# EAGLE schematic Teensy_v1 (EAGLE 9.2.1)
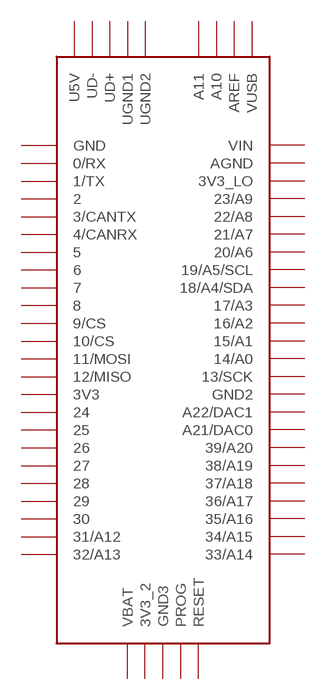
[diagram p0: schematic, sheet 1]

## Parts
U$1  TEENSY_3.5/3.6  [TEENSY_3.5/3.6]
Unconnected: U$1.0/RX U$1.1/TX U$1.2 U$1.3/CANTX U$1.3V3 U$1.3V3_2 U$1.3V3_LO U$1.4/CANRX U$1.5 U$1.6 U$1.7 U$1.8 U$1.9/CS U$1.10/CS U$1.11/MOSI U$1.12/MISO U$1.13/SCK U$1.14/A0 U$1.15/A1 U$1.16/A2 U$1.17/A3 U$1.18/A4/SDA U$1.19/A5/SCL U$1.20/A6 U$1.21/A7 U$1.21/DAC0(A21/DAC0) U$1.22/A8 U$1.23/A9 U$1.24 U$1.25 U$1.26 U$1.27 U$1.28 U$1.29 U$1.30 U$1.31/A12 U$1.32/A13 U$1.33/A14 U$1.34/A15 U$1.35/A16 U$1.36/A17 U$1.37/A18 U$1.38/A19 U$1.39/A20 U$1.A10 U$1.A11 U$1.A22/DAC1 U$1.AGND U$1.AREF U$1.GND U$1.GND2 U$1.GND3 U$1.PROG U$1.RESET U$1.U5V U$1.UD+ U$1.UD- U$1.UGND1 U$1.UGND2 U$1.VBAT U$1.VIN U$1.VUSB

## Library data of the parts
U$1 = Teensy356:TEENSY_3.5/3.6